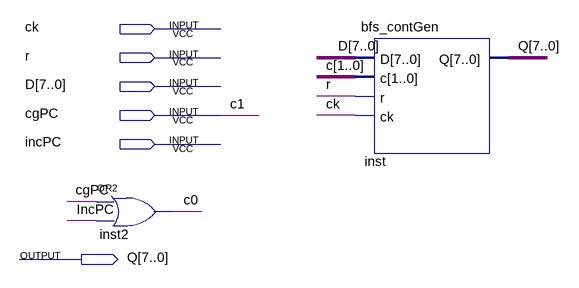
[diagram p0: schematic sheet]
// Quartus schematic bfs_PC.bdf as structural Verilog: 2 symbols, 6 pins
module bfs_PC (
  input  ck,
  input  r,
  input  [7:0] D,
  input  cgPC,
  input  incPC,
  output [7:0] Q
);

  wire [0:0] c;

  or inst2 (c[0], cgPC, incPC);
  bfs_contGen inst (.D(D), .c({cgPC, c[0]}), .r(r), .ck(ck), .Q(Q));

  // Other names for the same wires on the sheet: c[1] = cgPC; c1 = cgPC
endmodule
